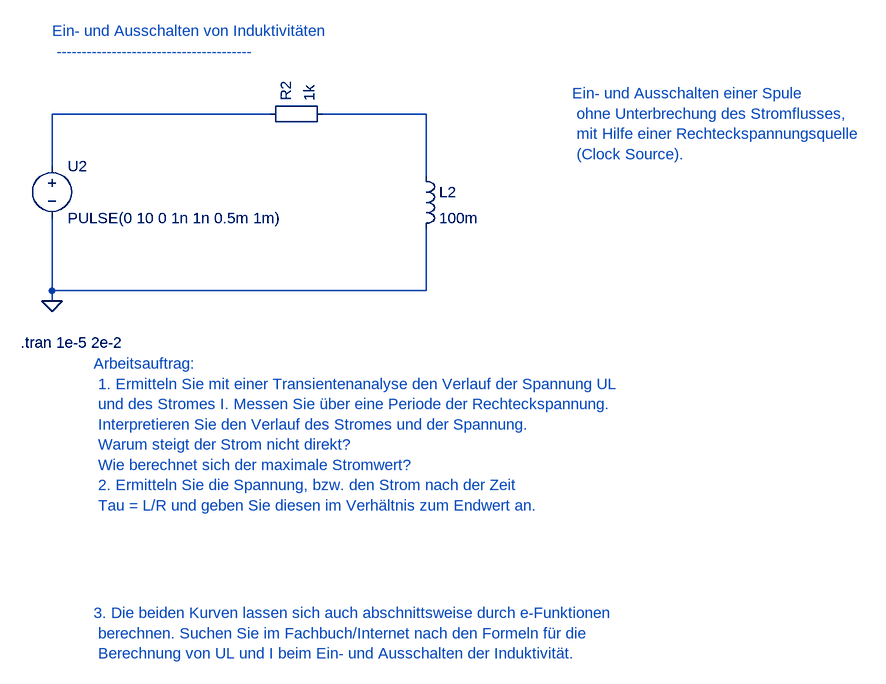
[diagram p0: schematic 1_2_3_Induktivitaet_an_Rechteckspannung.asc]
1_2_3_Induktivitaet_an_Rechteckspannung.asc, the LTspice schematic file:
Version 4
SHEET 1 880 680
WIRE 112 352 112 368
WIRE 528 192 688 192
WIRE 688 192 688 288
WIRE 112 272 112 192
WIRE 112 192 448 192
WIRE 112 368 112 464
WIRE 688 368 688 464
WIRE 688 464 112 464
WIRE 112 464 112 480
FLAG 112 480 0
SYMBOL Misc\EuropeanResistor 432 208 R270
SYMATTR InstName R2
SYMATTR Value 1k
SYMBOL ind 672 272 R0
SYMATTR InstName L2
SYMATTR Value 100m
SYMBOL voltage 112 256 R0
SYMATTR InstName U2
SYMATTR Value PULSE(0 10 0 1n 1n 0.5m 1m)
TEXT 64 544 Left 2 !.tran 1e-5 2e-2
TEXT 912 160 Left 2 ;Ein- und Ausschalten einer Spule \n ohne Unterbrechung des Stromflusses, \n mit Hilfe einer Rechteckspannungsquelle \n (Clock Source).
TEXT 112 64 Left 2 ;Ein- und Ausschalten von Induktivitäten \n ---------------------------------------
TEXT 176 576 Left 2 ;Arbeitsauftrag: \n 1. Ermitteln Sie mit einer Transientenanalyse den Verlauf der Spannung UL \n und des Stromes I. Messen Sie über eine Periode der Rechteckspannung. \n Interpretieren Sie den Verlauf des Stromes und der Spannung. \n Warum steigt der Strom nicht direkt? \n Wie berechnet sich der maximale Stromwert? \n 2. Ermitteln Sie die Spannung, bzw. den Strom nach der Zeit \n Tau = L/R und geben Sie diesen im Verhältnis zum Endwert an.
TEXT 176 960 Left 2 ;3. Die beiden Kurven lassen sich auch abschnittsweise durch e-Funktionen \n berechnen. Suchen Sie im Fachbuch/Internet nach den Formeln für die \n Berechnung von UL und I beim Ein- und Ausschalten der Induktivität.

The netlist it stands for:
* 1_2_3_Induktivitaet_an_Rechteckspannung.asc
R2 N002 N001 1k
L2 N001 0 100m
V§U2 N002 0 PULSE(0 10 0 1n 1n 0.5m 1m)
.tran 1e-5 2e-2
* Ein- und Ausschalten einer Spule
*  ohne Unterbrechung des Stromflusses,
*  mit Hilfe einer Rechteckspannungsquelle
*  (Clock Source).
* Ein- und Ausschalten von Induktivitäten
*  ---------------------------------------
* Arbeitsauftrag:
*  1. Ermitteln Sie mit einer Transientenanalyse den Verlauf der Spannung UL
*  und des Stromes I. Messen Sie über eine Periode der Rechteckspannung.
*  Interpretieren Sie den Verlauf des Stromes und der Spannung.
*  Warum steigt der Strom nicht direkt?
*  Wie berechnet sich der maximale Stromwert?
*  2. Ermitteln Sie die Spannung, bzw. den Strom nach der Zeit
*  Tau = L/R und geben Sie diesen im Verhältnis zum Endwert an.
* 3. Die beiden Kurven lassen sich auch abschnittsweise durch e-Funktionen
*  berechnen. Suchen Sie im Fachbuch/Internet nach den Formeln für die
*  Berechnung von UL und I beim Ein- und Ausschalten der Induktivität.
.backanno
.end